# EAGLE design wavenow-to-usb-sensor (EAGLE 6.5.0)
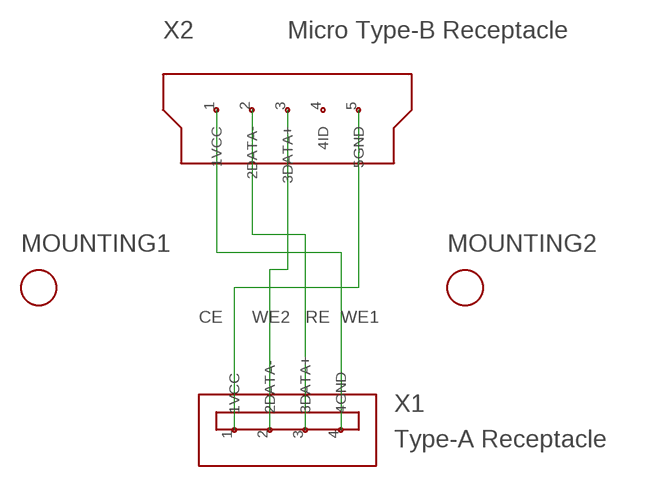
[diagram p0: schematic, sheet 1]

## Parts
MOUNTING1  M2-MOUNTING-HOLE  [M2-MOUNTING-HOLE]
MOUNTING2  M2-MOUNTING-HOLE  [M2-MOUNTING-HOLE]
X1  Type-A Receptacle  USB-TYPE-A-RECEPTACLE  [TE_CONNECTIVITY_292303-1]
X2  Micro Type-B Receptacle  USB-MICRO-TYPE-B-RECEPTACLE  [MOLEX_0548190519]

## Nets
CE: X1.1(1VCC) X2.5(5GND)
RE: X1.3(3DATA+) X2.2(2DATA-)
WE1: X1.4(4GND) X2.1(1VCC)
WE2: X1.2(2DATA-) X2.3(3DATA+)
Unconnected: X2.4(4ID)

## Library data of the parts
MOUNTING1 MOUNTING2 = sensor-breakout-boards:M2-MOUNTING-HOLE
X1 = sensor-breakout-boards:USB-TYPE-A-RECEPTACLE: USB Type-A Receptacle TE Connectivity Part No. 292303-1 Digi-key Part No. A31726-ND
X2 = sensor-breakout-boards:USB-MICRO-TYPE-B-RECEPTACLE: USB Micro Type-B Receptacle Molex Part No. 0548190519 Digi-key Part No. WM17115-ND

## Board
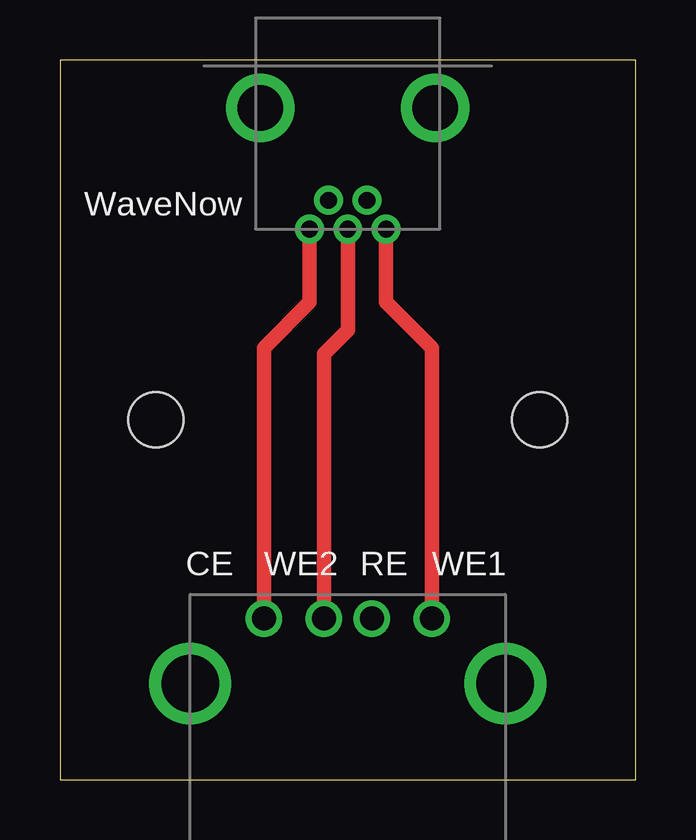
[diagram p1: board, top side]
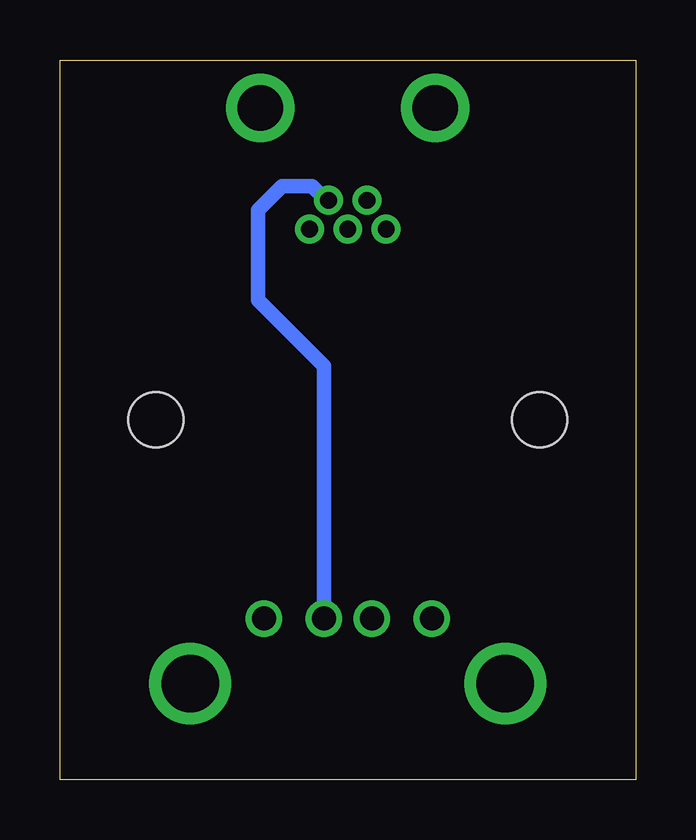
[diagram p2: board, bottom side, seen from below]

Size 24 x 30 mm. Coordinates in mm from the lower left corner, seen from the top.
Outline: 0,0 24,0 24,30 0,30 0,0
Copper layers (1*16): Top 0.035mm / dielectric 1.5mm / Bottom 0.035mm
Design rules "default *": minimum track width 10mil, minimum drill 24mil, track to track 8mil, track to pad 8mil, pad to pad 8mil, via to via 8mil, smd to smd 8mil, copper to edge 20mil, drill to drill 8mil, minimum pad ring 10mil, minimum via ring 8mil, stop-mask expansion 4mil, vias tented up to drill 0mil, thermal gap 10mil

### Footprints (pad centres in the part's own frame; a part is rotated, then mirrored left to right if it is on the bottom)
M2-MOUNTING-HOLE = hole 2.31: 0,0
TE_CONNECTIVITY_292303-1 = drill 1: 1 -3.5,2.71; 2 -1,2.71; 3 1,2.71; 4 3.5,2.71 | drill 2.4: CHAS@1 -6.57,0; CHAS@2 6.57,0
MOLEX_0548190519 = drill 0.7: 1 5.05,1.6; 2 3.85,0.8; 3 5.05,0; 4 3.85,-0.8; 5 5.05,-1.6 | drill 1.9 pad 2.54: CHAS@1 0,3.65; CHAS@2 0,-3.65

### Placement (x,y rotation side)
MOUNTING1  20,15 0 top
MOUNTING2  4,15 0 top
X1  12,4 0 top
X2  12,28 270 top

### Tracks (layer width: path | path; a pad name or v marks a point on that pad's centre or on a via)
CE
  Top 0.61: X2.5 10.4,19.9 8.5,18 X1.1
RE
  Bottom 0.61: X2.2 12.9,24.15 13.5,24.75 14.75,24.75 15.75,23.75 15.75,20 13,17.25 X1.3
WE1
  Top 0.61: X2.1 13.6,19.9 15.5,18 X1.4
WE2
  Top 0.61: X2.3 12,18.75 11,17.75 X1.2

### Text on the board
tPlace: WaveNow | CE | WE2 | RE | WE1